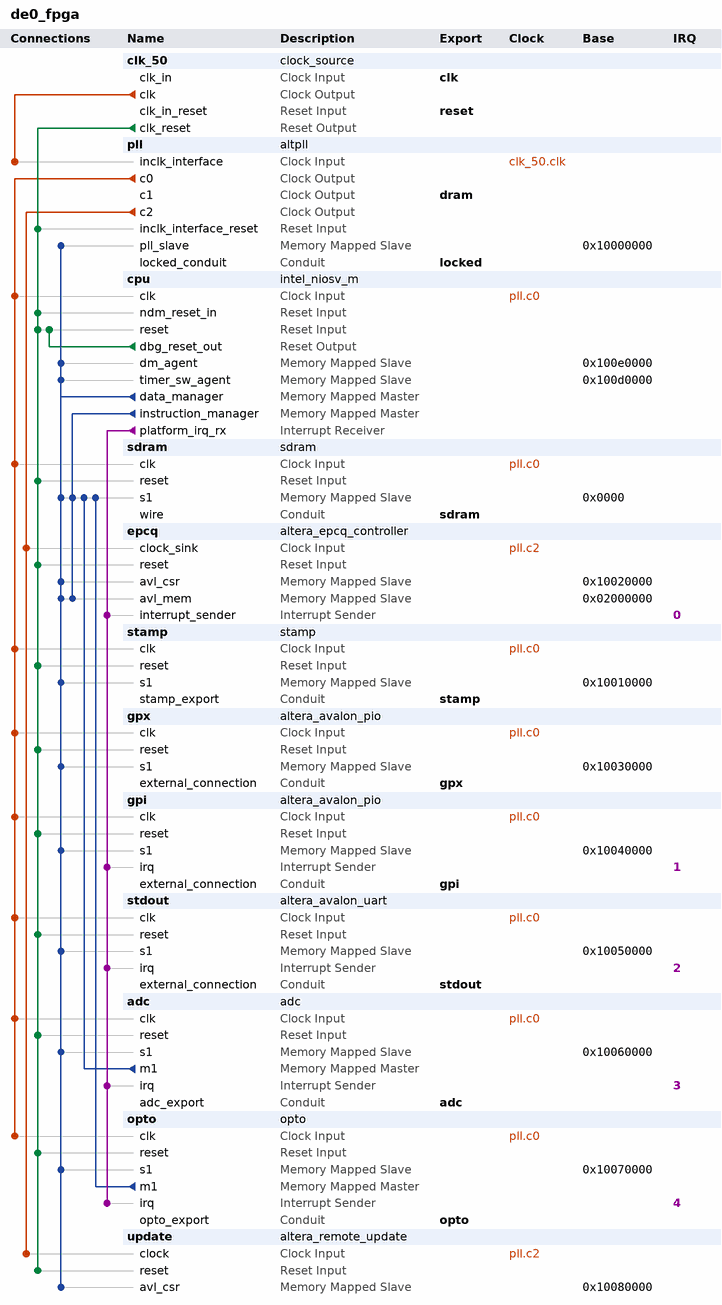
[diagram p0: system contents]
# Platform Designer (Qsys) system de0_fpga, Cyclone IV E EP4CE22F17C6
# Parameters at their usual value, and those the tool derives, are not listed.
package require -exact qsys 25.1
create_system de0_fpga
set_project_property DEVICE_FAMILY {Cyclone IV E}
set_project_property DEVICE EP4CE22F17C6

add_instance clk_50 clock_source 25.1
set_instance_parameter_value clk_50 clockFrequency 50000000

add_instance pll altpll 25.1
set_instance_parameter_value pll CLK0_DIVIDE_BY 1
set_instance_parameter_value pll CLK0_MULTIPLY_BY 2
set_instance_parameter_value pll CLK1_DIVIDE_BY 1
set_instance_parameter_value pll CLK1_DUTY_CYCLE 50
set_instance_parameter_value pll CLK1_MULTIPLY_BY 2
set_instance_parameter_value pll CLK1_PHASE_SHIFT -1667
set_instance_parameter_value pll CLK2_DIVIDE_BY 4
set_instance_parameter_value pll CLK2_DUTY_CYCLE 50
set_instance_parameter_value pll CLK2_MULTIPLY_BY 2
set_instance_parameter_value pll CLK2_PHASE_SHIFT 0
set_instance_parameter_value pll INCLK0_INPUT_FREQUENCY 20000
set_instance_parameter_value pll PORT_ARESET PORT_UNUSED
set_instance_parameter_value pll PORT_LOCKED PORT_USED
set_instance_parameter_value pll PORT_clk1 PORT_USED
set_instance_parameter_value pll PORT_clk2 PORT_USED
set_instance_parameter_value pll PORT_clk3 PORT_UNUSED

add_instance cpu intel_niosv_m 26.0.0
set_instance_parameter_value cpu clockFrequency 100000000
set_instance_parameter_value cpu enableAvalonInterface true
set_instance_parameter_value cpu enableDebugReset true
set_instance_parameter_value cpu enableECCFull false
set_instance_parameter_value cpu enableECCLite false
set_instance_parameter_value cpu hartId 0
set_instance_parameter_value cpu interruptMode 0
set_instance_parameter_value cpu pipelineArch false
set_instance_parameter_value cpu resetOffset 1048576
set_instance_parameter_value cpu resetSlave epcq.avl_mem

add_instance sdram sdram 22.1

add_instance epcq altera_epcq_controller 25.1
set_instance_parameter_value epcq CHIP_SELS 1
set_instance_parameter_value epcq DDASI 0
set_instance_parameter_value epcq FLASH_TYPE EPCS64
set_instance_parameter_value epcq IO_MODE STANDARD
set_instance_parameter_value epcq UNIQUE_ID {$${FILENAME}_epcq}
set_instance_parameter_value epcq clkFreq 25000000

add_instance stamp stamp 22.1

add_instance gpx altera_avalon_pio 25.1
set_instance_parameter_value gpx direction Bidir
set_instance_parameter_value gpx simDoTestBenchWiring true
set_instance_parameter_value gpx width 7

add_instance gpi altera_avalon_pio 25.1
set_instance_parameter_value gpi bitClearingEdgeCapReg true
set_instance_parameter_value gpi direction Input
set_instance_parameter_value gpi edgeType FALLING
set_instance_parameter_value gpi generateIRQ true
set_instance_parameter_value gpi simDoTestBenchWiring true
set_instance_parameter_value gpi width 7

add_instance stdout altera_avalon_uart 25.1
set_instance_parameter_value stdout baud 115200
set_instance_parameter_value stdout dataBits 8
set_instance_parameter_value stdout fixedBaud true
set_instance_parameter_value stdout parity NONE
set_instance_parameter_value stdout stopBits 1

add_instance adc adc 22.1

add_instance opto opto 22.1

add_instance update altera_remote_update 25.1
set_instance_parameter_value update CBX_AUTO_BLACKBOX ALL
set_instance_parameter_value update DEVICE EP4CE22F17C6
set_instance_parameter_value update GUI_config_device EPCQ256
set_instance_parameter_value update check_app_pof false
set_instance_parameter_value update check_avalon_interface true
set_instance_parameter_value update m_support_write_config_check true
set_instance_parameter_value update operation_mode REMOTE

# connections
add_connection clk_50.clk pll.inclk_interface clock
add_connection pll.c0 adc.clk clock
add_connection pll.c0 cpu.clk clock
add_connection pll.c0 gpi.clk clock
add_connection pll.c0 gpx.clk clock
add_connection pll.c0 opto.clk clock
add_connection pll.c0 sdram.clk clock
add_connection pll.c0 stamp.clk clock
add_connection pll.c0 stdout.clk clock
add_connection pll.c2 epcq.clock_sink clock
add_connection pll.c2 update.clock clock
add_connection clk_50.clk_reset adc.reset reset
add_connection clk_50.clk_reset cpu.ndm_reset_in reset
add_connection clk_50.clk_reset cpu.reset reset
add_connection clk_50.clk_reset epcq.reset reset
add_connection clk_50.clk_reset gpi.reset reset
add_connection clk_50.clk_reset gpx.reset reset
add_connection clk_50.clk_reset opto.reset reset
add_connection clk_50.clk_reset pll.inclk_interface_reset reset
add_connection clk_50.clk_reset sdram.reset reset
add_connection clk_50.clk_reset stamp.reset reset
add_connection clk_50.clk_reset stdout.reset reset
add_connection clk_50.clk_reset update.reset reset
add_connection cpu.dbg_reset_out cpu.reset reset
add_connection adc.m1 sdram.s1 avalon
set_connection_parameter_value adc.m1/sdram.s1 baseAddress 0x0000
add_connection cpu.data_manager adc.s1 avalon
set_connection_parameter_value cpu.data_manager/adc.s1 baseAddress 0x10060000
add_connection cpu.data_manager cpu.dm_agent avalon
set_connection_parameter_value cpu.data_manager/cpu.dm_agent baseAddress 0x100e0000
add_connection cpu.data_manager cpu.timer_sw_agent avalon
set_connection_parameter_value cpu.data_manager/cpu.timer_sw_agent baseAddress 0x100d0000
add_connection cpu.data_manager epcq.avl_csr avalon
set_connection_parameter_value cpu.data_manager/epcq.avl_csr baseAddress 0x10020000
add_connection cpu.data_manager epcq.avl_mem avalon
set_connection_parameter_value cpu.data_manager/epcq.avl_mem baseAddress 0x02000000
add_connection cpu.data_manager gpi.s1 avalon
set_connection_parameter_value cpu.data_manager/gpi.s1 baseAddress 0x10040000
add_connection cpu.data_manager gpx.s1 avalon
set_connection_parameter_value cpu.data_manager/gpx.s1 baseAddress 0x10030000
add_connection cpu.data_manager opto.s1 avalon
set_connection_parameter_value cpu.data_manager/opto.s1 baseAddress 0x10070000
add_connection cpu.data_manager pll.pll_slave avalon
set_connection_parameter_value cpu.data_manager/pll.pll_slave baseAddress 0x10000000
add_connection cpu.data_manager sdram.s1 avalon
set_connection_parameter_value cpu.data_manager/sdram.s1 baseAddress 0x0000
add_connection cpu.data_manager stamp.s1 avalon
set_connection_parameter_value cpu.data_manager/stamp.s1 baseAddress 0x10010000
add_connection cpu.data_manager stdout.s1 avalon
set_connection_parameter_value cpu.data_manager/stdout.s1 baseAddress 0x10050000
add_connection cpu.data_manager update.avl_csr avalon
set_connection_parameter_value cpu.data_manager/update.avl_csr baseAddress 0x10080000
add_connection cpu.instruction_manager epcq.avl_mem avalon
set_connection_parameter_value cpu.instruction_manager/epcq.avl_mem baseAddress 0x02000000
add_connection cpu.instruction_manager sdram.s1 avalon
set_connection_parameter_value cpu.instruction_manager/sdram.s1 baseAddress 0x0000
add_connection opto.m1 sdram.s1 avalon
set_connection_parameter_value opto.m1/sdram.s1 baseAddress 0x0000
add_connection cpu.platform_irq_rx adc.irq interrupt
set_connection_parameter_value cpu.platform_irq_rx/adc.irq irqNumber 3
add_connection cpu.platform_irq_rx epcq.interrupt_sender interrupt
set_connection_parameter_value cpu.platform_irq_rx/epcq.interrupt_sender irqNumber 0
add_connection cpu.platform_irq_rx gpi.irq interrupt
set_connection_parameter_value cpu.platform_irq_rx/gpi.irq irqNumber 1
add_connection cpu.platform_irq_rx opto.irq interrupt
set_connection_parameter_value cpu.platform_irq_rx/opto.irq irqNumber 4
add_connection cpu.platform_irq_rx stdout.irq interrupt
set_connection_parameter_value cpu.platform_irq_rx/stdout.irq irqNumber 2

# exported interfaces
add_interface adc conduit end
set_interface_property adc EXPORT_OF adc.adc_export
add_interface clk clock sink
set_interface_property clk EXPORT_OF clk_50.clk_in
add_interface dram clock source
set_interface_property dram EXPORT_OF pll.c1
add_interface gpi conduit end
set_interface_property gpi EXPORT_OF gpi.external_connection
add_interface gpx conduit end
set_interface_property gpx EXPORT_OF gpx.external_connection
add_interface locked conduit end
set_interface_property locked EXPORT_OF pll.locked_conduit
add_interface opto conduit end
set_interface_property opto EXPORT_OF opto.opto_export
add_interface reset reset sink
set_interface_property reset EXPORT_OF clk_50.clk_in_reset
add_interface sdram conduit end
set_interface_property sdram EXPORT_OF sdram.wire
add_interface stamp conduit end
set_interface_property stamp EXPORT_OF stamp.stamp_export
add_interface stdout conduit end
set_interface_property stdout EXPORT_OF stdout.external_connection

set_interconnect_requirement {$system} qsys_mm.clockCrossingAdapter HANDSHAKE
set_interconnect_requirement {$system} qsys_mm.enableEccProtection FALSE
set_interconnect_requirement {$system} qsys_mm.insertDefaultSlave FALSE
set_interconnect_requirement {$system} qsys_mm.maxAdditionalLatency 1

save_system de0_fpga.qsys
